# EAGLE schematic Extension_Unit Schematic (EAGLE 7.6.0)
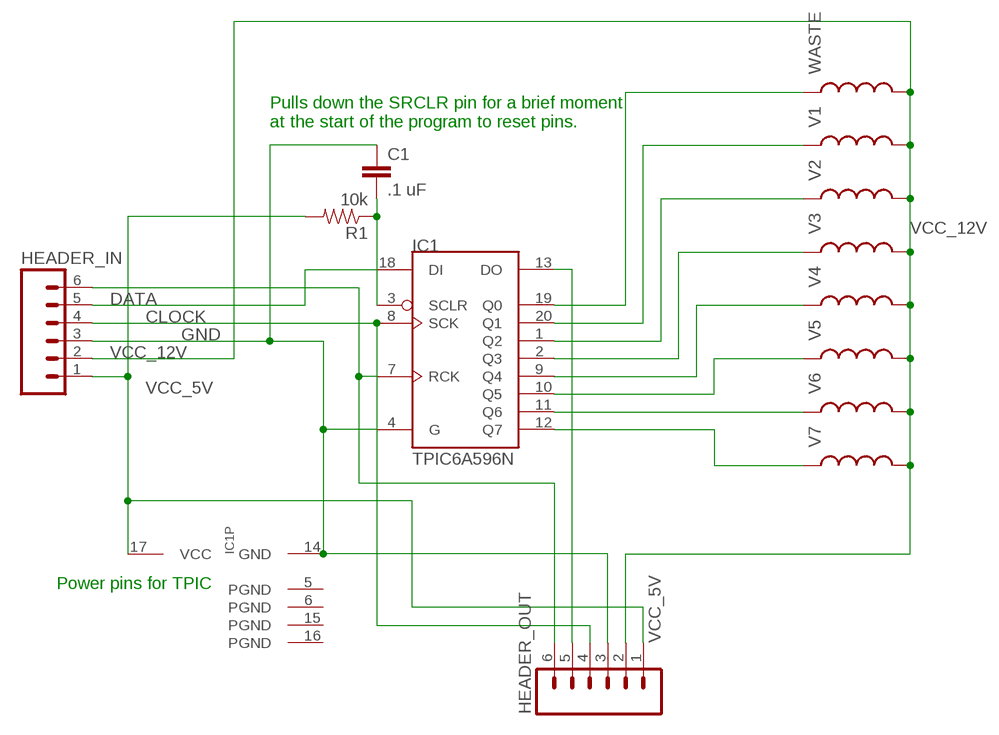
[diagram p0: schematic, sheet 1]

## Parts
C1  .1 uF  CAP_  [AXIAL-5MM]
HEADER_IN  M06SILK_FEMALE_PTH  [1X06]
HEADER_OUT  M06SILK_FEMALE_PTH  [1X06]
IC1  TPIC6A596N  [DIL20]
R1  10k  RESISTORAXIAL-0.3  [AXIAL-0.3]
V1  INDUCTOR  [INDUCTOR-SRP4020]
V2  INDUCTOR  [INDUCTOR-SRP4020]
V3  INDUCTOR  [INDUCTOR-SRP4020]
V4  INDUCTOR  [INDUCTOR-SRP4020]
V5  INDUCTOR  [INDUCTOR-SRP4020]
V6  INDUCTOR  [INDUCTOR-SRP4020]
V7  INDUCTOR  [INDUCTOR-SRP4020]
WASTE  INDUCTOR  [INDUCTOR-SRP4020]

## Nets
CLOCK: HEADER_IN.4 HEADER_OUT.4 IC1.8(SCK)
DATA: HEADER_IN.5 IC1.18(DI)
GND: C1.P$1 HEADER_IN.3 HEADER_OUT.3 IC1.4(G) IC1.14(GND)
N$1: IC1.19(Q0) WASTE.P$1
N$2: IC1.20(Q1) V1.P$1
N$3: IC1.1(Q2) V2.P$1
N$4: IC1.2(Q3) V3.P$1
N$5: IC1.9(Q4) V4.P$1
N$6: IC1.10(Q5) V5.P$1
N$7: IC1.11(Q6) V6.P$1
N$8: IC1.12(Q7) V7.P$1
N$10: HEADER_OUT.5 IC1.13(DO)
N$11: HEADER_IN.6 HEADER_OUT.6 IC1.7(RCK)
N$12: C1.P$2 IC1.3(SCLR) R1.P$1
VCC_5V: HEADER_IN.1 HEADER_OUT.1 IC1.17(VCC) R1.P$2
VCC_12V: HEADER_IN.2 HEADER_OUT.2 V1.P$2 V2.P$2 V3.P$2 V4.P$2 V5.P$2 V6.P$2 V7.P$2 WASTE.P$2

## Notes on the sheet
- Pulls down the SRCLR pin for a brief moment
  at the start of the program to reset pins.
- Power pins for TPIC

## Power pins joined to a net without a drawn wire
PGND: IC1.5(PGND) IC1.6(PGND) IC1.15(PGND) IC1.16(PGND)

## Library data of the parts
C1 = SparkFun-Capacitors:CAP: Capacitor Standard 0603 ceramic capacitor, and 0.1" leaded capacitor.
HEADER_IN HEADER_OUT = SparkFun-Connectors:M06: Header 6 Standard 6-pin 0.1" header. Use with straight break away headers (SKU : PRT-00116), right angle break away headers (PRT-00553), swiss pins (PRT-00743), machine pins (PRT-00117), and female headers (PRT-00115). Molex polarized connector foot print use with SKU : PRT-08094 with associated crimp pins and housings. NOTES ON THE VARIANTS LOCK and LOCK_LONGPADS... This footprint was designed to help hold the alignment of a through-hole component (i.e. 6-pin header) while soldering it into place. You may notice that each hole has been shifted either up or down by 0.005 of an inch from it's more standard position (which is a perfectly straight line). This slight alteration caused the pins (the squares in the middle) to touch the edges of the holes. Because they are alternating, it causes a "brace" to hold the component in place. 0.005 has proven to be the perfect amount of "off-center" position when using our standard breakaway headers. Although looks a little odd when you look at the bare footprint, once you have a header in there, the alteration is very hard to notice. Also,if you push a header all the way into place, it is covered up entirely on the bottom side. This idea of altering the position of holes to aid alignment will be further integrated into the Sparkfun Library for other footprints. It can help hold any component with 3 or more connection pins.; PROD_ID: CONN-08437
IC1 = tpic:TPIC6A596N
R1 = SparkFun-Passives:RESISTOR: Resistor Basic schematic elements and footprints for 0603, 1206, and PTH resistors.
V1-V7 WASTE = SparkFun-Passives:INDUCTOR: Inductors Basic Inductor/Choke - 0603 and 1206. Footprints are not proven and vary greatly between part numbers. INDUCTOR POWER 3.3UH 4.0A SMD 0.197" L x 0.197" W x 0.177" H (5.00mm x 5.00mm x 4.50mm)